# Altium schematic sheet 18.RK3588_PCIE30_PCIE20_SATA30.SchDoc
size 420 x 297 mm; Revision: V2.1; Schematic Page Number: 11; Page Number: 18; Check: <Checker>; Schematic Name: RK_NVR_DEMO1_RK3588_LP4/4x_V21; Page Count: 43; Page name: 18.RK3588_PCIE30/PCIE20/SATA30; Designer: Zhangdz; Schematic Page Count: 99; Revcode: V2.1; DsnPath: E:\Work\SBER\RK3588_SOM\temp\RK_NVR_DEMO1_RK3588_LP4XD200P232SD8_V21_20211228.DSN; SchematicName: RK_NVR_DEMO1_RK3588_LP4/4x_V21; PageName: 18.RK3588_PCIE30/PCIE20/SATA30; PageSize: A3; TopSchematic: True
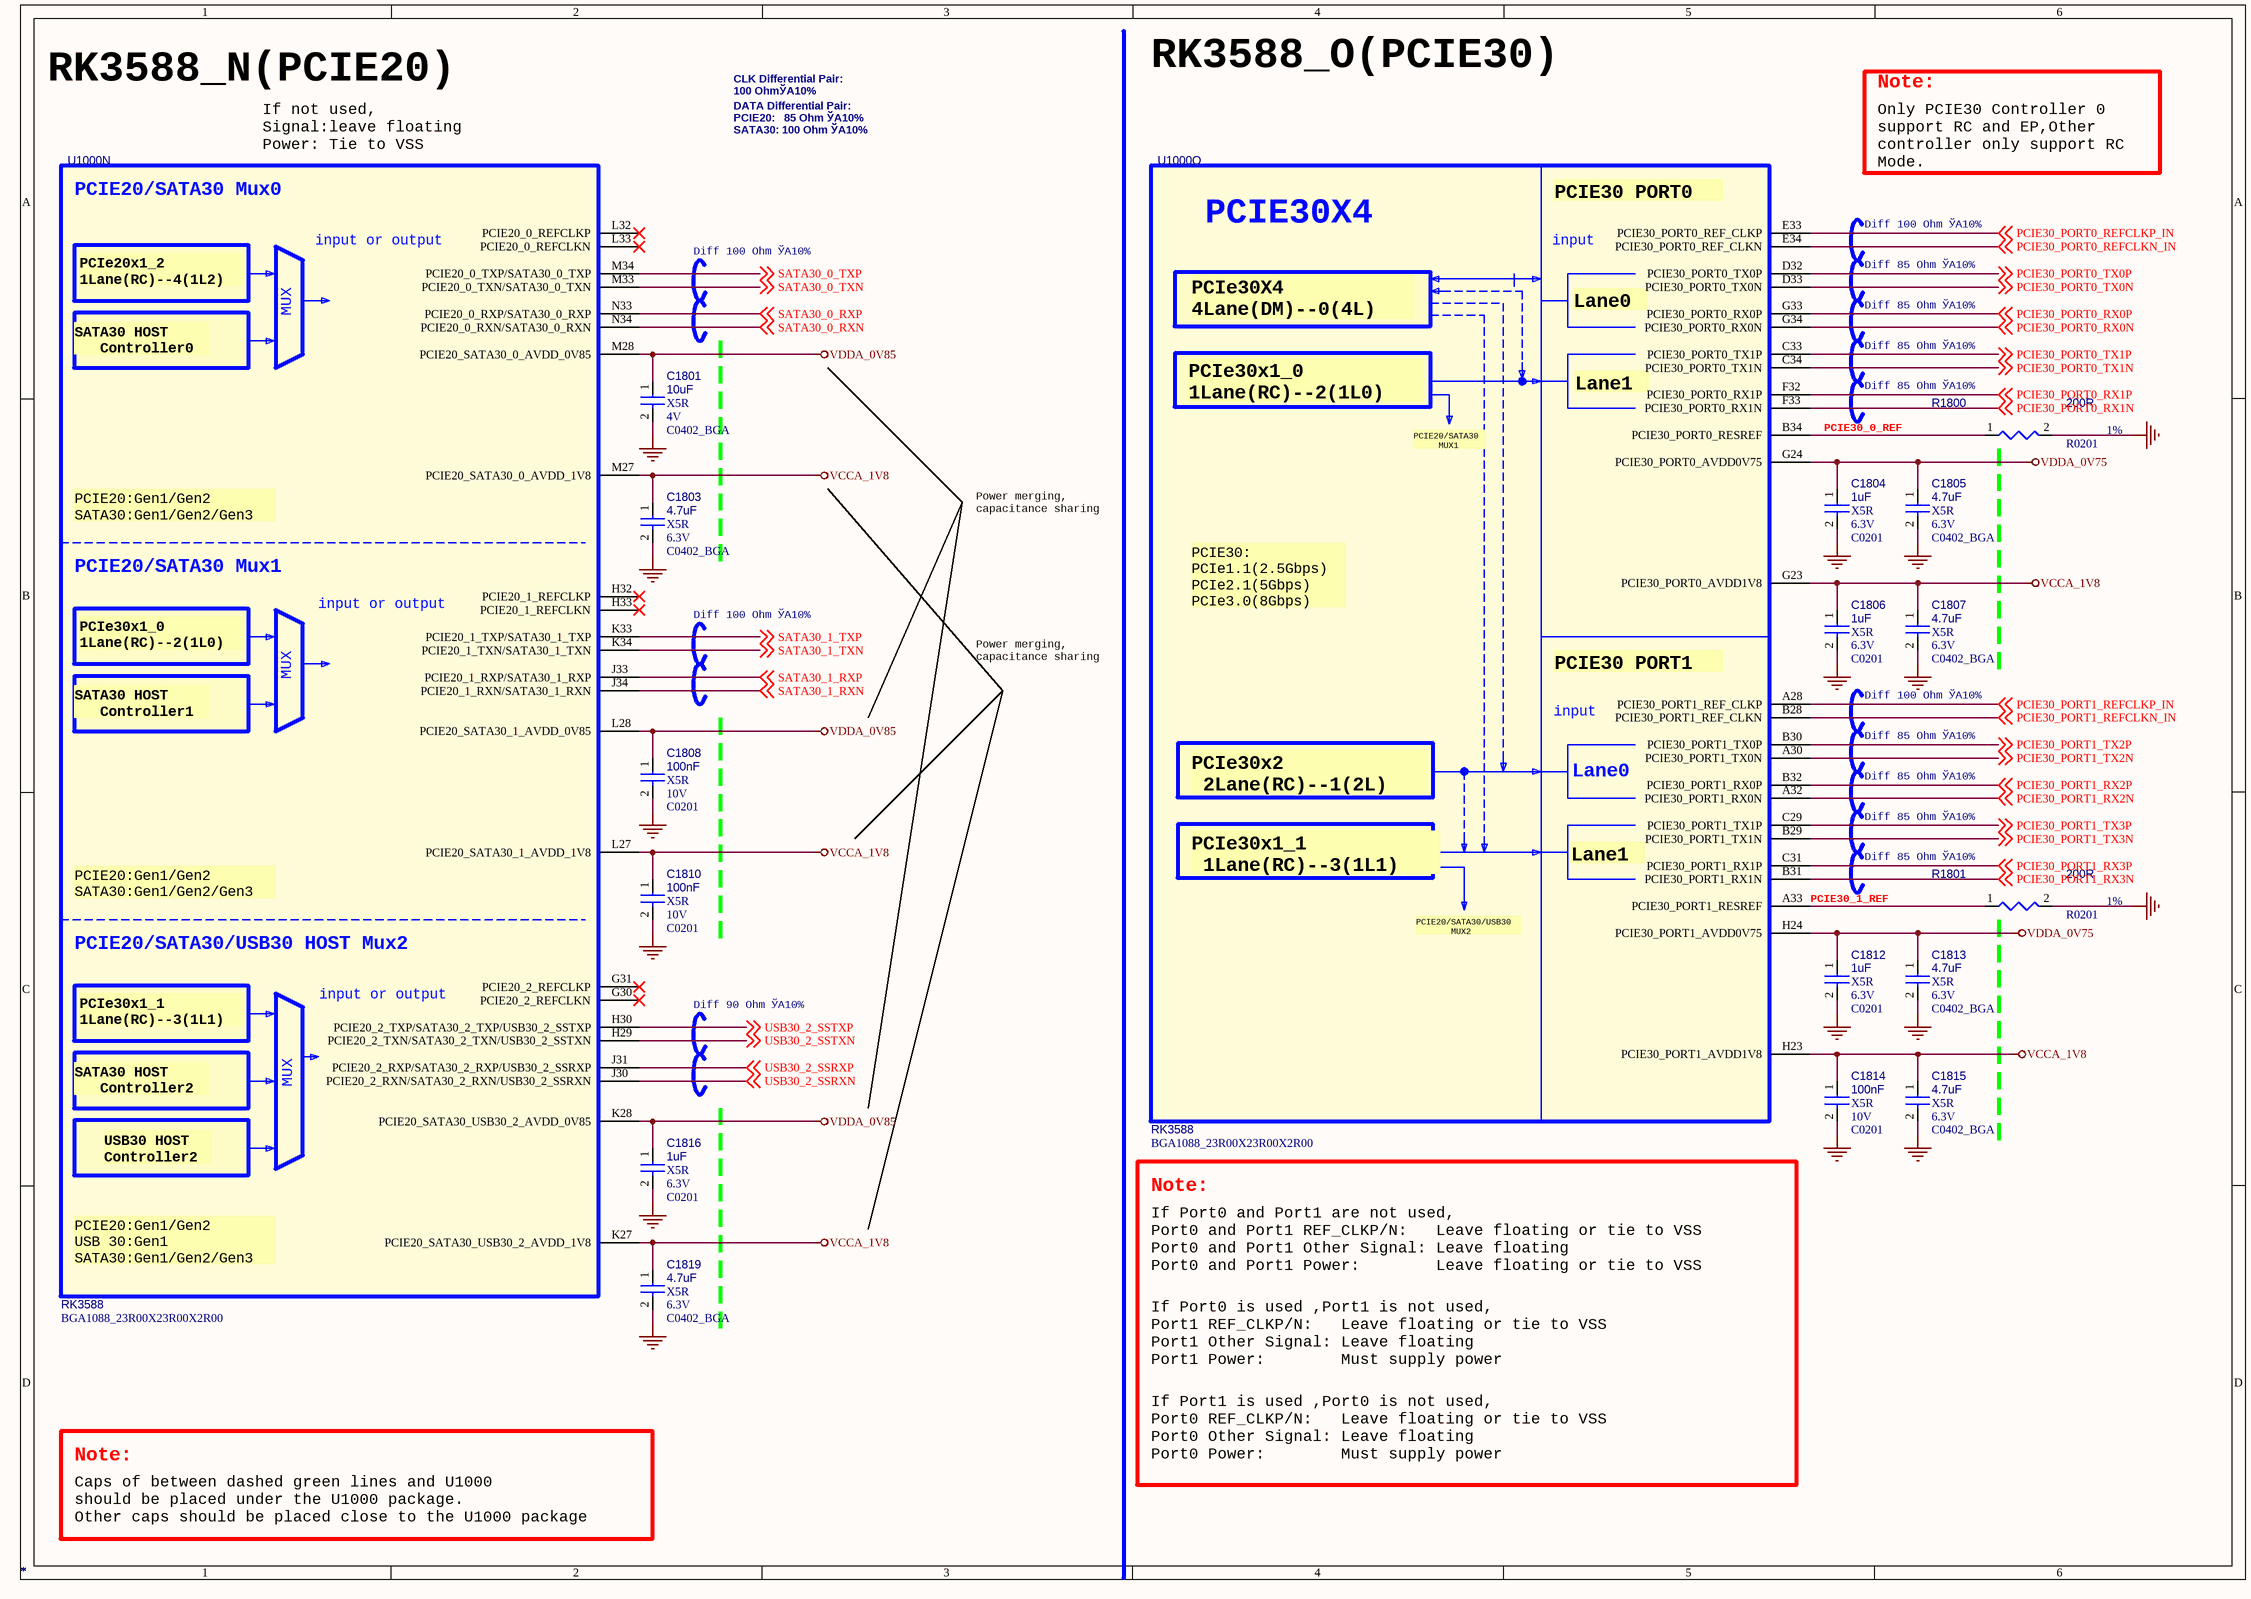
[diagram p0: 18.RK3588_PCIE30_PCIE20_SATA30.SchDoc]

## Parts
C1801  *  Voltage: 4V  Dielectric: X5R  [C0402_BGA]
C1803  *  Voltage: 6.3V  Dielectric: X5R  [C0402_BGA]
C1804  *  Voltage: 6.3V  Dielectric: X5R  [C0201]
C1805  *  Voltage: 6.3V  Dielectric: X5R  [C0402_BGA]
C1806  *  Voltage: 6.3V  Dielectric: X5R  [C0201]
C1807  *  Voltage: 6.3V  Dielectric: X5R  [C0402_BGA]
C1808  *  Voltage: 10V  Dielectric: X5R  [C0201]
C1810  *  Voltage: 10V  Dielectric: X5R  [C0201]
C1812  *  Voltage: 6.3V  Dielectric: X5R  [C0201]
C1813  *  Voltage: 6.3V  Dielectric: X5R  [C0402_BGA]
C1814  *  Voltage: 10V  Dielectric: X5R  [C0201]
C1815  *  Voltage: 6.3V  Dielectric: X5R  [C0402_BGA]
C1816  *  Voltage: 6.3V  Dielectric: X5R  [C0201]
C1819  *  Voltage: 6.3V  Dielectric: X5R  [C0402_BGA]
R1800  *  PCB Footprint: R0201  Tolerance: 1%  [R0402]
R1801  *  PCB Footprint: R0201  Tolerance: 1%  [R0402]
U1000  *  [BGA1088_23R00X23R00X2R00]  (parts N,O of 26)

## Nets
GND: C1801.2 C1803.2 C1804.2 C1805.2 C1806.2 C1807.2 C1808.2 C1810.2 C1812.2 C1813.2 C1814.2 C1815.2 C1816.2 C1819.2 R1800.2 R1801.2
VCCA_1V8: C1803.1 C1806.1 C1807.1 C1810.1 C1814.1 C1815.1 C1819.1 U1000.G23(PCIE30_PORT0_AVDD1V8) U1000.H23(PCIE30_PORT1_AVDD1V8) U1000.K27(PCIE20_SATA30_USB30_2_AVDD_1V8) U1000.L27(PCIE20_SATA30_1_AVDD_1V8) U1000.M27(PCIE20_SATA30_0_AVDD_1V8)
VDDA_0V75: C1804.1 C1805.1 C1812.1 C1813.1 U1000.G24(PCIE30_PORT0_AVDD0V75) U1000.H24(PCIE30_PORT1_AVDD0V75)
VDDA_0V85: C1801.1 C1808.1 C1816.1 U1000.K28(PCIE20_SATA30_USB30_2_AVDD_0V85) U1000.L28(PCIE20_SATA30_1_AVDD_0V85) U1000.M28(PCIE20_SATA30_0_AVDD_0V85)
PCIE30_0_REF: R1800.1 U1000.B34(PCIE30_PORT0_RESREF)
PCIE30_1_REF: R1801.1 U1000.A33(PCIE30_PORT1_RESREF)
PCIE30_PORT0_REFCLKN_IN: U1000.E34(PCIE30_PORT0_REF_CLKN) ; off-sheet PCIE30_PORT0_REFCLKN_IN
PCIE30_PORT0_REFCLKP_IN: U1000.E33(PCIE30_PORT0_REF_CLKP) ; off-sheet PCIE30_PORT0_REFCLKP_IN
PCIE30_PORT0_RX0N: U1000.G34(PCIE30_PORT0_RX0N) ; off-sheet PCIE30_PORT0_RX0N
PCIE30_PORT0_RX0P: U1000.G33(PCIE30_PORT0_RX0P) ; off-sheet PCIE30_PORT0_RX0P
PCIE30_PORT0_RX1N: U1000.F33(PCIE30_PORT0_RX1N) ; off-sheet PCIE30_PORT0_RX1N
PCIE30_PORT0_RX1P: U1000.F32(PCIE30_PORT0_RX1P) ; off-sheet PCIE30_PORT0_RX1P
PCIE30_PORT0_TX0N: U1000.D33(PCIE30_PORT0_TX0N) ; off-sheet PCIE30_PORT0_TX0N
PCIE30_PORT0_TX0P: U1000.D32(PCIE30_PORT0_TX0P) ; off-sheet PCIE30_PORT0_TX0P
PCIE30_PORT0_TX1N: U1000.C34(PCIE30_PORT0_TX1N) ; off-sheet PCIE30_PORT0_TX1N
PCIE30_PORT0_TX1P: U1000.C33(PCIE30_PORT0_TX1P) ; off-sheet PCIE30_PORT0_TX1P
PCIE30_PORT1_REFCLKN_IN: U1000.B28(PCIE30_PORT1_REF_CLKN) ; off-sheet PCIE30_PORT1_REFCLKN_IN
PCIE30_PORT1_REFCLKP_IN: U1000.A28(PCIE30_PORT1_REF_CLKP) ; off-sheet PCIE30_PORT1_REFCLKP_IN
PCIE30_PORT1_RX2N: U1000.A32(PCIE30_PORT1_RX0N) ; off-sheet PCIE30_PORT1_RX2N
PCIE30_PORT1_RX2P: U1000.B32(PCIE30_PORT1_RX0P) ; off-sheet PCIE30_PORT1_RX2P
PCIE30_PORT1_RX3N: U1000.B31(PCIE30_PORT1_RX1N) ; off-sheet PCIE30_PORT1_RX3N
PCIE30_PORT1_RX3P: U1000.C31(PCIE30_PORT1_RX1P) ; off-sheet PCIE30_PORT1_RX3P
PCIE30_PORT1_TX2N: U1000.A30(PCIE30_PORT1_TX0N) ; off-sheet PCIE30_PORT1_TX2N
PCIE30_PORT1_TX2P: U1000.B30(PCIE30_PORT1_TX0P) ; off-sheet PCIE30_PORT1_TX2P
PCIE30_PORT1_TX3N: U1000.B29(PCIE30_PORT1_TX1N) ; off-sheet PCIE30_PORT1_TX3N
PCIE30_PORT1_TX3P: U1000.C29(PCIE30_PORT1_TX1P) ; off-sheet PCIE30_PORT1_TX3P
SATA30_0_RXN: U1000.N34(PCIE20_0_RXN/SATA30_0_RXN) ; off-sheet SATA30_0_RXN
SATA30_0_RXP: U1000.N33(PCIE20_0_RXP/SATA30_0_RXP) ; off-sheet SATA30_0_RXP
SATA30_0_TXN: U1000.M33(PCIE20_0_TXN/SATA30_0_TXN) ; off-sheet SATA30_0_TXN
SATA30_0_TXP: U1000.M34(PCIE20_0_TXP/SATA30_0_TXP) ; off-sheet SATA30_0_TXP
SATA30_1_RXN: U1000.J34(PCIE20_1_RXN/SATA30_1_RXN) ; off-sheet SATA30_1_RXN
SATA30_1_RXP: U1000.J33(PCIE20_1_RXP/SATA30_1_RXP) ; off-sheet SATA30_1_RXP
SATA30_1_TXN: U1000.K34(PCIE20_1_TXN/SATA30_1_TXN) ; off-sheet SATA30_1_TXN
SATA30_1_TXP: U1000.K33(PCIE20_1_TXP/SATA30_1_TXP) ; off-sheet SATA30_1_TXP
USB30_2_SSRXN: U1000.J30(PCIE20_2_RXN/SATA30_2_RXN/USB30_2_SSRXN) ; off-sheet USB30_2_SSRXN
USB30_2_SSRXP: U1000.J31(PCIE20_2_RXP/SATA30_2_RXP/USB30_2_SSRXP) ; off-sheet USB30_2_SSRXP
USB30_2_SSTXN: U1000.H29(PCIE20_2_TXN/SATA30_2_TXN/USB30_2_SSTXN) ; off-sheet USB30_2_SSTXN
USB30_2_SSTXP: U1000.H30(PCIE20_2_TXP/SATA30_2_TXP/USB30_2_SSTXP) ; off-sheet USB30_2_SSTXP

Not connected (* = marked no-connect by the designer): U1000 G30(PCIE20_2_REFCLKN)* G31(PCIE20_2_REFCLKP)* H32(PCIE20_1_REFCLKP)* H33(PCIE20_1_REFCLKN)* L32(PCIE20_0_REFCLKP)* L33(PCIE20_0_REFCLKN)*

## Notes on the sheet
- RK3588_N(PCIE20)
- CLK Differential Pair:
  100 OhmЎА10%
- RK3588_O(PCIE30)
- Note:
- If not used,
  Signal:leave floating
  Power: Tie to VSS
- DATA Differential Pair:
  PCIE20:   85 Ohm ЎА10%
  SATA30: 100 Ohm ЎА10%
- Only PCIE30 Controller 0
  support RC and EP,Other
  controller only support RC
  Mode.
- Diff 100 Ohm ЎА10%
- Diff 85 Ohm ЎА10%
- Power merging,
  capacitance sharing
- Diff 90 Ohm ЎА10%
- If Port0 and Port1 are not used,
  Port0 and Port1 REF_CLKP/N:   Leave floating or tie to VSS
  Port0 and Port1 Other Signal: Leave floating
  Port0 and Port1 Power:        Leave floating or tie to VSS
- If Port0 is used ,Port1 is not used,
  Port1 REF_CLKP/N:   Leave floating or tie to VSS
  Port1 Other Signal: Leave floating
  Port1 Power:        Must supply power
- If Port1 is used ,Port0 is not used,
  Port0 REF_CLKP/N:   Leave floating or tie to VSS
  Port0 Other Signal: Leave floating
  Port0 Power:        Must supply power
- Caps of between dashed green lines and U1000
  should be placed under the U1000 package.
  Other caps should be placed close to the U1000 package
- (in symbol SOC_RK3588, part N) PCIE20/SATA30 Mux0; input or output; PCIe20x1_2 / 1Lane(RC)--4(1L2); MUX; SATA30 HOST / Controller0; PCIE20:Gen1/Gen2 / SATA30:Gen1/Gen2/Gen3; PCIE20/SATA30 Mux1; PCIe30x1_0 / 1Lane(RC)--2(1L0); SATA30 HOST / Controller1; PCIE20/SATA30/USB30 HOST Mux2; PCIe30x1_1 / 1Lane(RC)--3(1L1); SATA30 HOST / Controller2; USB30 HOST / Controller2; PCIE20:Gen1/Gen2 / USB 30:Gen1 / SATA30:Gen1/Gen2/Gen3
- (in symbol SOC_RK3588, part O) PCIE30 PORT0 /; PCIE30X4; input; Lane0 /; PCIe30X4 / 4Lane(DM)--0(4L); Lane1 /; PCIe30x1_0 / 1Lane(RC)--2(1L0); PCIE20/SATA30 / MUX1; PCIE30: / PCIe1.1(2.5Gbps) / PCIe2.1(5Gbps) / PCIe3.0(8Gbps) /; PCIE30 PORT1 /; Lane0; PCIe30x2 / 2Lane(RC)--1(2L); PCIe30x1_1 / 1Lane(RC)--3(1L1); PCIE20/SATA30/USB30 / MUX2

## Library data of the parts
C1801 = CAP NP: cap,10.00uF,+/-20%,4V,X5R,C0402; Part Reference: C1801; Manufacturer PN: CC0402MRX5R4BB106; Manufacturer: YAGEO; Value: 10uF; Tolerance: 20%; Priority: A; PCB Footprint: C0402_BGA; Created by: JJJ; Part Type: C0402; RK PN: CC0402MRX5R4BB106
C1803 = CAP NP: cap,4.70uF,+/-10%,6.3V,X5R,C0402; Part Reference: C1803; Manufacturer PN: C1005X5R0J475K050BC; Manufacturer: TDK; Value: 4.7uF; Tolerance: 10%; Priority: A; PCB Footprint: C0402_BGA; Created by: JJJ; Part Type: C0402; RK PN: C1005X5R0J475K050BC
C1804 = CAP NP: cap,1.00uF,+/-20%,6.3V,X5R,C0201; Part Reference: C1804; Manufacturer: TDK; Value: 1uF; RK PN: C0603X5R0J105M030BC; Priority: A; Tolerance: 20%; PCB Footprint: C0201; Part Type: C0201; Manufacturer PN: C0603X5R0J105M030BC; Created by: JJJ
C1805 = CAP NP: cap,4.70uF,+/-10%,6.3V,X5R,C0402; Part Reference: C1805; Manufacturer PN: C1005X5R0J475K050BC; Manufacturer: TDK; Value: 4.7uF; Tolerance: 10%; Priority: A; PCB Footprint: C0402_BGA; Created by: JJJ; Part Type: C0402; RK PN: C1005X5R0J475K050BC
C1806 = CAP NP: cap,1.00uF,+/-20%,6.3V,X5R,C0201; Part Reference: C1806; Manufacturer PN: C0603X5R0J105M030BC; Manufacturer: TDK; Value: 1uF; Tolerance: 20%; Priority: A; PCB Footprint: C0201; Created by: JJJ; Part Type: C0201; RK PN: C0603X5R0J105M030BC
C1807 = CAP NP: cap,4.70uF,+/-10%,6.3V,X5R,C0402; Part Reference: C1807; Manufacturer PN: C1005X5R0J475K050BC; Manufacturer: TDK; Value: 4.7uF; Tolerance: 10%; Priority: A; PCB Footprint: C0402_BGA; Created by: JJJ; Part Type: C0402; RK PN: C1005X5R0J475K050BC
C1808 = CAP NP: cap,100.00nF,+/-10%,10V,X5R,C0201; Part Reference: C1808; Manufacturer PN: C0603X5R1A104K030BC; Manufacturer: TDK; Value: 100nF; Tolerance: 10%; Priority: A; PCB Footprint: C0201; Created by: JJJ; Part Type: C0201; RK PN: C0603X5R1A104K030BC
C1810 = CAP NP: cap,100.00nF,+/-10%,10V,X5R,C0201; Part Reference: C1810; Manufacturer: TDK; Value: 100nF; RK PN: C0603X5R1A104K030BC; Priority: A; Tolerance: 10%; PCB Footprint: C0201; Part Type: C0201; Manufacturer PN: C0603X5R1A104K030BC; Created by: JJJ
C1812 = CAP NP: cap,1.00uF,+/-20%,6.3V,X5R,C0201; Part Reference: C1812; Manufacturer: TDK; Value: 1uF; RK PN: C0603X5R0J105M030BC; Priority: A; Tolerance: 20%; PCB Footprint: C0201; Part Type: C0201; Manufacturer PN: C0603X5R0J105M030BC; Created by: JJJ
C1813 = CAP NP: cap,4.70uF,+/-10%,6.3V,X5R,C0402; Part Reference: C1813; Manufacturer PN: C1005X5R0J475K050BC; Manufacturer: TDK; Value: 4.7uF; Tolerance: 10%; Priority: A; PCB Footprint: C0402_BGA; Created by: JJJ; Part Type: C0402; RK PN: C1005X5R0J475K050BC
C1814 = CAP NP: cap,100.00nF,+/-10%,10V,X5R,C0201; Part Reference: C1814; Manufacturer PN: C0603X5R1A104K030BC; Manufacturer: TDK; Value: 100nF; Tolerance: 10%; Priority: A; PCB Footprint: C0201; Created by: JJJ; Part Type: C0201; RK PN: C0603X5R1A104K030BC
C1815 = CAP NP: cap,4.70uF,+/-10%,6.3V,X5R,C0402; Part Reference: C1815; Manufacturer PN: C1005X5R0J475K050BC; Manufacturer: TDK; Value: 4.7uF; Tolerance: 10%; Priority: A; PCB Footprint: C0402_BGA; Created by: JJJ; Part Type: C0402; RK PN: C1005X5R0J475K050BC
C1816 = CAP NP: cap,1.00uF,+/-20%,6.3V,X5R,C0201; Part Reference: C1816; Manufacturer PN: C0603X5R0J105M030BC; Manufacturer: TDK; Value: 1uF; Tolerance: 20%; Priority: A; PCB Footprint: C0201; Created by: JJJ; Part Type: C0201; RK PN: C0603X5R0J105M030BC
C1819 = CAP NP: cap,4.70uF,+/-10%,6.3V,X5R,C0402; Part Reference: C1819; Manufacturer PN: C1005X5R0J475K050BC; Manufacturer: TDK; Value: 4.7uF; Tolerance: 10%; Priority: A; PCB Footprint: C0402_BGA; Created by: JJJ; Part Type: C0402; RK PN: C1005X5R0J475K050BC
R1800 = RESISTOR_Dup1: НЁУГєсД¤µзЧи,200R,+/-1%,R0201,1/20W.; Part Reference: R1800; Manufacturer PN: RC0201FR-07200RL; Manufacturer: YAGEO; Wattage: 1/20W; Priority: A; Value: 200R; Created by: YTL; Part Type: НЁУГєсД¤µзЧи; RK PN: RC0201FR-07200RL
R1801 = RESISTOR_Dup1: НЁУГєсД¤µзЧи,200R,+/-1%,R0201,1/20W.; Part Reference: R1801; Manufacturer PN: RC0201FR-07200RL; Manufacturer: YAGEO; Wattage: 1/20W; Priority: A; Value: 200R; Created by: YTL; Part Type: НЁУГєсД¤µзЧи; RK PN: RC0201FR-07200RL
U1000 = SOC_RK3588: ROCKCHIP SOC; Part Reference: U1000; Manufacturer: Rockchip (ИрРѕОў); SPLIT_INST: TRUE; SWAP_INFO: (S1+S2+S3+S4+S5+S6+S7+S8+S9+S10+S11+S12+S13+S14+S15+S16+S17+S18+S19+S20+S21+S22+S23+S24+S25+S26); Value: RK3588; Priority: A; RK PN: RK3588; Part Type: SOC; Manufacturer PN: RK3588; Created by: YWQ; PCB Footprint: BGA1088_23R00X23R00X2R00